# Altium schematic sheet Monitoreo-Bateria.SchDoc
size Letter; ApprovedBy: M. en C. Fernando Bolaños; CheckedBy: M. en C. José Alberto Balderas Castillo (CID); Author: M. en C. José Alberto Balderas Castillo (CID); Revision: v1; NombreTarjeta: TELCOMGPRS-v1; NumeroDeHoja: 6 de 7; NombreBloque: Monitoreo del Voltaje de Alimentación de la Bateria; FechaDiseno: 02-Junio-2015; FechaRevision: 05-Junio-2015; FechaAprobacion: 16-Junio-2015; TamanoHoja: Carta; NombreProyecto: Telemetria GPRS de Bajo Consumo de Energia
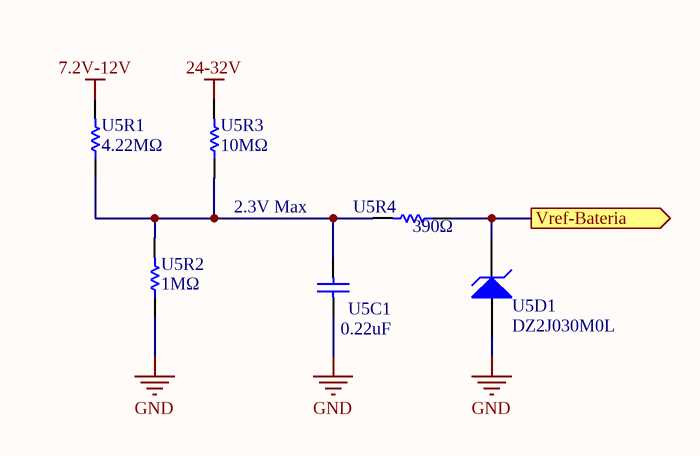
[diagram p0: Monitoreo-Bateria.SchDoc]

## Parts
U5C1  0.22uF  [0603 - CAP]
U5D1  DZ2J030M0L  [SOD-323]
U5R1  4.22MΩ  [0805-RES]
U5R2  1MΩ  [0805-RES]
U5R3  10MΩ  [0805-RES]
U5R4  390Ω  [0603-RES]

## Ports
Vref-Bateria (out)

## Nets
7.2V-12V: U5R1.2
24-32V: U5R3.2
GND: U5C1.2 U5D1.1(A) U5R2.1
Vref-Bateria: U5D1.2(K) U5R4.1 ; port Vref-Bateria
NetU5C1_1: U5C1.1 U5R1.1 U5R2.2 U5R3.1 U5R4.2

## Notes on the sheet
- 2.3V Max
- Elaboró
- Fecha
- Nombre del artículo
- Revisó
- Aprobó
- Número de parte
- Revisión
- Escala
- N/A
- Sección afectada
- Descripción del cambio
- Lámina
- 1/1
- Tolerancias
- Ruta del archivo

## Library data of the parts
U5C1 = Cap: CAP CER 0.22UF 16V 10% X7R 0603; Manufacturer: Kemet; Manufacturer Part Number: C0603C224K4RAC7867; Value: 0.22uF; Supplier 1: Digi-Key; Supplier Part Number 1: 399-5619-1-ND
U5D1 = D Zener: PANASONIC ELECTRONIC COMPONENTS  DZ2J030M0L  DIODE, ZENER, 3.0V, SMINI2-F5-B; Supplier 1: Digi-Key; Supplier Part Number 1: DZ2J030M0LCT-ND; Manufacturer: Panasonic Electronic Components; Manufacturer Part Number: DZ2J030M0L
U5R1 = Res1: VISHAY  CRCW08054M22FKEA  Resistencia SMD Chip, Película Gruesa, 4.22 Mohm, 150 V, 0805 [2012 Metric], 125 mW, ± 1%; Manufacturer: Vishay Dale; Value: 4.22MΩ; Supplier 1: Digi-Key; Supplier Part Number 1: 541-4.22MCCT-ND; Manufacturer Part Number: CRCW08054M22FKEA; Supplier 2: Mouser; Supplier Part Number 2: 71-CRCW08054M22FKEA; Supplier 3: Newark; Supplier Part Number 3: 53K0223
U5R2 = Res1: VISHAY  CRCW08051M00FKEB  Resistencia SMD Chip, Película Gruesa, 1 Mohm, 150 V, 0805 [2012 Metric], 125 mW, ± 1%; Manufacturer Part Number: CRCW08051M00FKEA; Value: 1MΩ; Supplier 1: Digi-Key; Supplier Part Number 1: 541-1.00MCCT-ND; Manufacturer: VISHAY; Supplier 2: Newark; Supplier Part Number 2: 52K9759
U5R3 = Res1: VISHAY  CRCW080510M0JNEA  Resistencia SMD Chip, Película Gruesa, 10 Mohm, 150 V, 0805 [2012 Metric], 125 mW, ± 5%; Manufacturer: Vishay Dale; Value: 10MΩ; Supplier 1: Digi-Key; Supplier Part Number 1: 541-10MACT-ND; Manufacturer Part Number: CRCW080510M0JNEA
U5R4 = Res1: YAGEO  RC0603JR-07390RL  Resistencia SMD Chip, Película Gruesa, Serie RC, 390 ohm, 50 V, 0603 [1608 Metric], 100 mW, ± 5%; Value: 390Ω; Supplier 1: Digi-Key; Supplier Part Number 1: 311-390GRCT-ND; Manufacturer: Yageo; Manufacturer Part Number: RC0603JR-07390RL